# EAGLE design mainBoard (EAGLE 9.6.2)
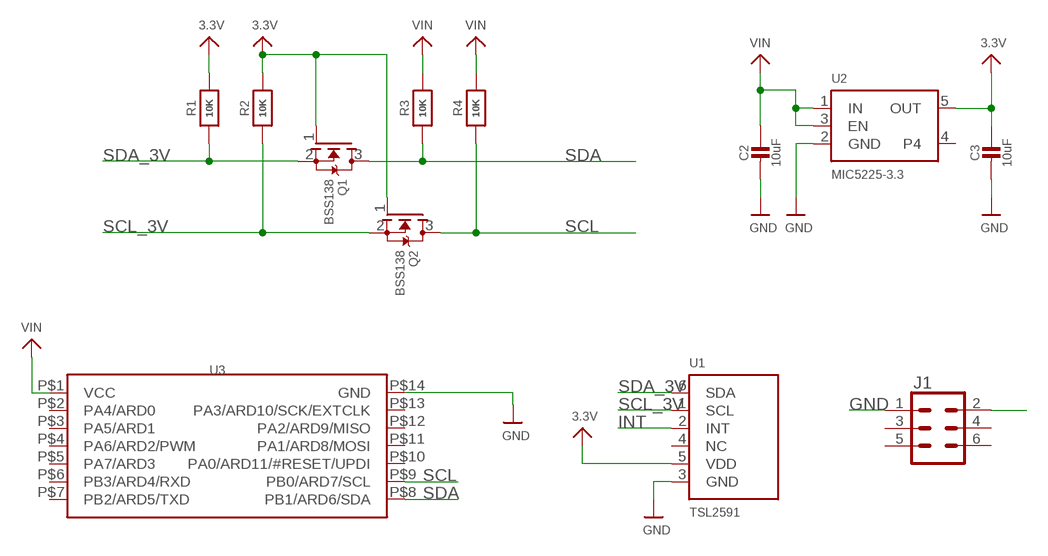
[diagram p0: schematic, sheet 1]

## Parts
C2  10uF  CAP_CERAMIC0805-NOOUTLINE  [0805-NO]
C3  10uF  CAP_CERAMIC0805-NOOUTLINE  [0805-NO]
J1  CONN_03X22X3_SILK_MALE_PTH  [2X3]
Q1  BSS138  MOSFET-NWIDE  [SOT23-WIDE]
Q2  BSS138  MOSFET-NWIDE  [SOT23-WIDE]
R1  10K  RESISTOR0805_NOOUTLINE  [0805-NO]
R2  10K  RESISTOR0805_NOOUTLINE  [0805-NO]
R3  10K  RESISTOR0805_NOOUTLINE  [0805-NO]
R4  10K  RESISTOR0805_NOOUTLINE  [0805-NO]
U1  TSL2591  LIGHT_TSL2591  [DFN6_TAOS]
U2  MIC5225-3.3  VREG_SOT23-5  [SOT23-5]
U3  ATTINY1604  [SOIC150]

## Nets
3.3V: C3.1 Q1.1(G) Q2.1(G) R1.2 R2.2 U1.5(VDD) U2.5(OUT)
GND: C2.2 C3.2 J1.1 U1.3(GND) U2.2(GND) U3.P$14(GND)
INT: U1.2(INT)
SCL: Q2.3(D) R4.1 U3.P$9(PB0/ARD7/SCL)
SCL_3V: Q2.2(S) R2.1 U1.1(SCL)
SDA: Q1.3(D) R3.1 U3.P$8(PB1/ARD6/SDA)
SDA_3V: Q1.2(S) R1.1 U1.6(SDA)
VIN: C2.1 J1.2 R3.2 R4.2 U2.1(IN) U2.3(EN) U3.P$1(VCC)
Unconnected: J1.3 J1.4 J1.5 J1.6 U1.4(NC) U2.4 U3.P$2(PA4/ARD0) U3.P$3(PA5/ARD1) U3.P$4(PA6/ARD2/PWM) U3.P$5(PA7/ARD3) U3.P$6(PB3/ARD4/RXD) U3.P$7(PB2/ARD5/TXD) U3.P$10(PA0/ARD11/#RESET/UPDI) U3.P$11(PA1/ARD8/MOSI) U3.P$12(PA2/ARD9/MISO) U3.P$13(PA3/ARD10/SCK/EXTCLK)

## Library data of the parts
C2 C3 = microbuilder:CAP_CERAMIC: Ceramic Capacitors For new designs, use the packages preceded by an '_' character since they are more reliable: The following footprints should be used on most boards: _0402 - Standard footprint for regular board layouts _0603 - Standard footprint for regular board layouts _0805 - Standard footprint for regular board layouts _1206 - Standard footprint for regular board layouts For extremely tight-pitch boards where space is at a premium, the following 'micro-pitch' footprints can be used (smaller pads, no silkscreen outline, etc.): _0402MP - Micro-pitch footprint for very dense/compact boards _0603MP - Micro-pitch footprint for very dense/compact boards _0805MP - Micro-pitch footprint for very dense/compact boards _1206MP - Micro-pitch footprint for very dense/compact boards
J1 = SparkFun-Connectors:CONN_03X2: Multi connection point. Often used as Generic Header-pin footprint for 0.1 inch spaced/style header connections You can populate with any combo of single row headers, but if you'd like an exact match, check these: Header - 2x3 (Male, 0.1") <https://www.sparkfun.com/products/12807> (PRT-12807) Header - 2x3 (Female, 0.1") <https://www.sparkfun.com/products/13010> (PRT-13010) 2x3 Pin Shrouded Header <https://www.sparkfun.com/products/10877> (PRT-10877) On any of the 0.1 inch spaced packages, you can populate with these: Break Away Headers - Straight <https://www.sparkfun.com/products/116> (PRT-00116) Break Away Male Headers - Right Angle <https://www.sparkfun.com/products/553> (PRT-00553) Female Headers <https://www.sparkfun.com/products/115> (PRT-00115) Break Away Headers - Machine Pin <https://www.sparkfun.com/products/117> (PRT-00117) Break Away Female Headers - Swiss Machine Pin <https://www.sparkfun.com/products/743> (PRT-00743) Special note: the shrouded connector mates well with our 3x2 ribbon cables: Ribbon Crimp Connector - 6-pin (2x3, Female) <https://www.sparkfun.com/products/10651> (PRT-10651) Ribbon Cable - 6 wire (15ft) <https://www.sparkfun.com/products/10646> (PRT-10646); PROD_ID: CONN-09701
Q1 Q2 = microbuilder:MOSFET-N: N-Channel Mosfet LEGEND VDS: Voltage Drain-Source ID: Drain Current RDS(ON): Drain-Source On-State Resistance VGS(TH): Gate-Source Threshold Voltage CISS: Drain-Source Input Capacitance SOT-23 Name VDS ID RDS(ON) VGS(TH) CISS Order Number 2N7002E 60V 260mA 2.5 Ohm 2.5V @ 250uA 26.7pF @ 25V 2N7002ET1GOSTR-ND BSH103 30V 850mA 400 mOhm 400mV @ 1mA 83pF @ 24V BSH103,235-ND BSS138 60V 320mA 1.6 Ohm 1.5V @ 250uA 50pF @ 10V Mouser: 771-BSS138PW115 DMN2075U-7 20V 4.2A 38 mOhm 1V @ 250 uA 594.3pF @ 10V DMN2075U-7DICT-ND * BSS138 good choice for I2C level-shifting POWERPAK 1212-8 Name VDS ID RDS(ON) VGS(TH) CISS Order Number Si7308DN 60V 6A 58 mOhm 3V @ 250uA 665pF @ 15V SI7308DN-T1-E3CT-ND
R1-R4 = microbuilder:RESISTOR: Resistors For new designs, use the packages preceded by an '_' character since they are more reliable: The following footprints should be used on most boards: _0402 - Standard footprint for regular board layouts _0603 - Standard footprint for regular board layouts _0805 - Standard footprint for regular board layouts _1206 - Standard footprint for regular board layouts For extremely tight-pitch boards where space is at a premium, the following 'micro-pitch' footprints can be used (smaller pads, no silkscreen outline, etc.): _0402MP - Micro-pitch footprint for very dense/compact boards _0603MP - Micro-pitch footprint for very dense/compact boards _0805MP - Micro-pitch footprint for very dense/compact boards _1206MP - Micro-pitch footprint for very dense/compact boards
U1 = microbuilder:LIGHT_TSL2591: TSL2591 Light-To-Digital Sensor
U2 = microbuilder:VREG_SOT23-5: SOT23-5 Fixed Voltage Regulators Part Current Out V Out V In V Dropout θJA (°C/W) TJ (°C) Digikey Part No. ADP121 150mA 3.3V 3.4-5.5V 0.09V @ 150mA -- -- ADP121-AUJZ33R7CT-ND ADP121 150mA 3.0V 3.1-5.5V 0.09V @ 150mA -- -- ADP121-AUJZ30R7CT-ND ADP122 300mA 3.3V 3.4-5.5V 0.085V @ 300mA -- -- ADP122AUJZ-3.3-R7CT-ND ADP1712 300mA 3.3V 3.5-5.5V 0.17V @ 300mA -- -- ADP1712AUJZ-3.3-R7TR-ND AP7311 (Low Cost) 150mA 3.3V 3.5-6V 0.15V @ 150mA -- -- AP7311-33WG-7DICT-ND LD39015M18R 150mA 1.8V 1.9V-5.5V 0.08V @ 100mA -- -- 497-6977-1-ND LP2985A-33DBVR 150mA 3.3V 3.3-16V 0.28V @ 150mA 206 150 296-18479-1-ND MCP1824T-3302E/OT 300mA 3.3V 3.5V-6V 0.2V @ 300mA -- -- MCP1824T-3302E/OTCT-ND MIC5205-2.5YM5 TR 150mA 2.5V 2.7-16V 0.165V @ 150mA -- -- 576-1257-2-ND MIC5205-3.0YM5 TR 150mA 3.0V 3.2V-16V 0.165V @ 150mA -- -- 576-1258-2-ND MIC5205-3.3YM5 TR 150mA 3.3V 3.5V-16V 0.165V @ 150mA -- -- 576-1259-2-ND TPS780330220 150mA 3.3V+2.2V 3.6-5.5V 250mV Max -- -- 296-23332-1-ND TDA3663/N1,135 100mA 3.3V 3.5-45V 0.18V @ 50mA -- -- 568-5343-1-ND Max operating temp can be calculated using θJA, TJ (max junction temperature), and power in watts. Set the "Maximum Ambient Temperature" until it reaches TJ ("Max Junction Temperature"), which is the absolute limit for safe use of the regulator: Heat Sink Temperature Calculator <http://www.daycounter.com/Calculators/Heat-Sink-Temperature-Calculator.phtml> For example, With 12V source into a 3.3V LP2985 and a 30mA load, we are dissipating (12V-3.3V) * 0.03A = 0.261W. With a θJA of 206 °C/W, a TJ of 150°C, and 261mW we can safely use the chip without a heat sink up to 75°C (=147.1°C Junction Temperature).
U3 = attiny1604:ATTINY1604: The ATtiny804/1604 microcontrollers are using the high-performance, low-power AVR® RISC architecture,and are capable of running at up to 20 MHz, with up to 8/16 KB Flash, 512/1024 bytes of SRAM, and128/256 bytes of EEPROM in a 14-pin package. The series uses the latest technologies with a flexibleand low-power architecture including Event System and SleepWalking, accurate analog features andadvanced peripherals.

## Board
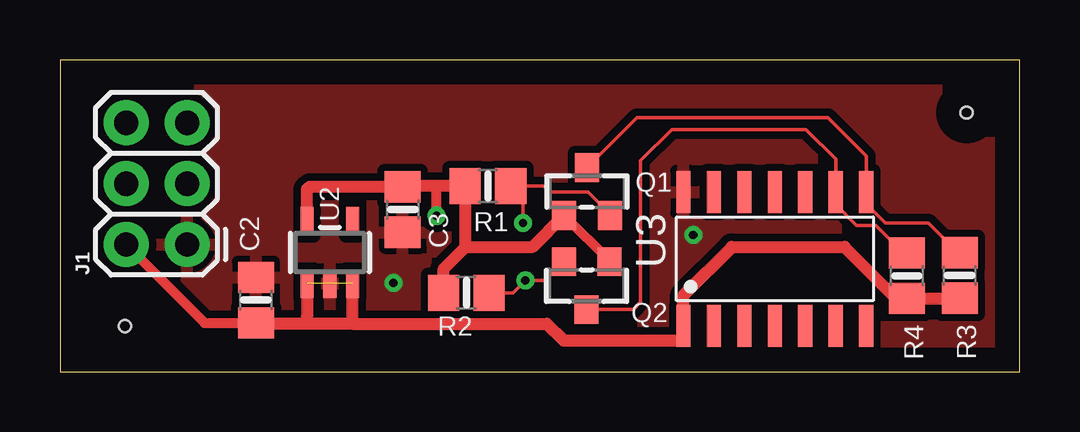
[diagram p1: board, top side]
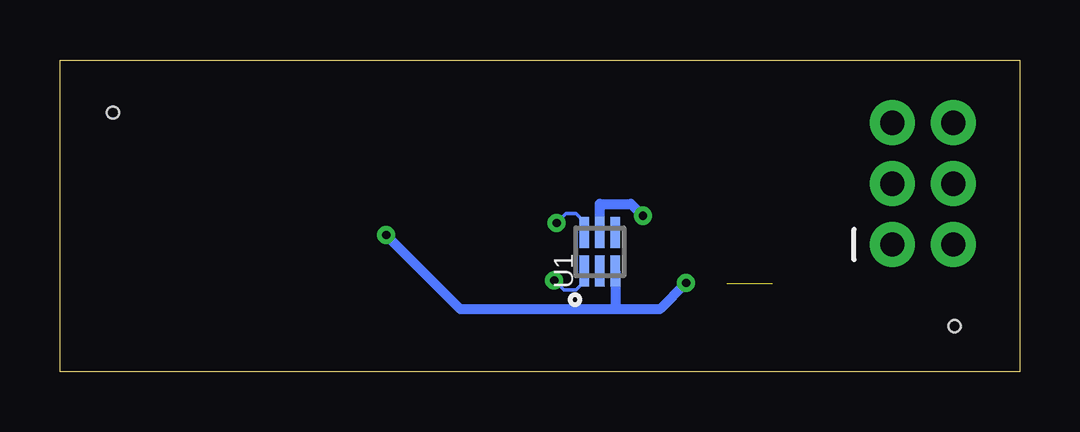
[diagram p2: board, bottom side, seen from below]

Size 40 x 13 mm. Coordinates in mm from the lower left corner, seen from the top.
Outline: 0,0 40,0 40,13 0,13 0,0
Copper layers (1*16): Top 0.035mm / dielectric 1.5mm / Bottom 0.035mm
Design rules "default": minimum track width 6mil, minimum drill 0.35mm, track to track 6mil, track to pad 6mil, pad to pad 6mil, via to via 6mil, smd to smd 6mil, copper to edge 40mil, drill to drill 6mil, minimum pad ring 10mil, minimum via ring 8mil, stop-mask expansion 4mil, vias tented up to drill 0mil, thermal gap 10mil
Holes 0.5 mm at 37.8,10.8 2.7,1.9

### Footprints (pad centres in the part's own frame; a part is rotated, then mirrored left to right if it is on the bottom)
0805-NO = smd 1.3 x 1.5: 1 -0.95,0; 2 0.95,0
2X3 = drill 1.016 pad 1.88: 1 0,0; 2 0,2.54; 3 2.54,0; 4 2.54,2.54; 5 5.08,0; 6 5.08,2.54
SOT23-WIDE = smd 1 x 1.2: 1 -0.95,-1; 2 0.95,-1; 3 0,1
DFN6_TAOS = smd 1.3 x 0.4: 1 -0.8,0.65; 2 -0.8,0; 3 -0.8,-0.65; 4 0.8,-0.65; 5 0.8,0; 6 0.8,0.65
SOT23-5 = smd 0.55 x 1.2: 1 -0.95,-1.3; 2 0,-1.3; 3 0.95,-1.3; 4 0.95,1.3; 5 -0.95,1.3
SOIC150 = smd 0.6 x 1.75: P$1 -3.81,-2.8; P$2 -2.54,-2.8; P$3 -1.27,-2.8; P$4 0,-2.8; P$5 1.27,-2.8; P$6 2.54,-2.8; P$7 3.81,-2.8; P$8 3.81,2.8; P$9 2.54,2.8; P$10 1.27,2.8; P$11 0,2.8; P$12 -1.27,2.8; P$13 -2.54,2.8; P$14 -3.81,2.8

### Placement (x,y rotation side)
C2  8.17,2.98 90 top
C3  14.29,6.76 270 top
J1  5.3,5.3 90 top
Q1  21.97,7.51 0 top
Q2  21.95,3.58 180 top
R1  17.84,7.74 180 top
R2  16.94,3.29 180 top
R3  37.5,4.01 270 top
R4  35.3,4 270 top
U1  17.5,5 90 bottom
U2  11.25,4.97 0 top
U3  29.8,4.7 0 top

### Tracks (layer width: path | path; a pad name or v marks a point on that pad's centre or on a via)
3.3V  (via drill 0.35)
  Top 0.152: 10.24,6.21 U2.5 | R2.2 | R1.2 17,7.63 | 14.3,7.74 C3.1
  Top 0.406: Q1.1 22.9,4.63 Q2.1 | v15.7,6.5 15.7,7.64 15.6,7.74
  Top 0.508: U2.5 10.3,7.6 10.41,7.71 C3.1 14.32,7.74 15.6,7.74 R1.2 16.89,5.21 16.9,5.2 | R2.2 15.99,4.29 16.9,5.2 | Q1.1 19.71,5.2 16.9,5.2
  Bottom 0.406: U1.5 17.5,7 16.2,7 v15.7,6.5
GND  (via drill 0.35)
  Top 0.152: 11.3,3.72 U2.2
  Bottom 0.406: v13.9,3.7 15,2.6 16.8,2.6 | 16.8,2.6 23.3,2.6 v26.4,5.7 | U1.3 16.85,2.65 16.8,2.6
  pour Top (isolate 0.305): -0.4,13.4 -0.4,13.7 40.7,13.7 40.7,-0.7 -0.7,-0.7 -0.7,13.4
SCL
  Top 0.152: U3.P$9 32.34,6.96 33.2,6.1 34,6.1 35.15,4.95 R4.1 | U3.P$9 32.3,7.54 | Q2.3 21.97,2.6 23.9,2.6 24.2,2.9 24.2,8.8 25.5,10.1 31.1,10.1 32.34,8.86 U3.P$9
SCL_3V  (via drill 0.35)
  Top 0.152: 20.98,4.6 Q2.2 20.22,3.8 v19.4,3.8 18.89,3.29 R2.1
  Bottom 0.152: U1.1 18.15,3.75 18.5,3.4 19,3.4 v19.4,3.8
SDA
  Top 0.152: R3.1 37.44,4.96 36.2,6.2 34.4,6.2 33.61,6.99 U3.P$8 33.61,8.99 32,10.6 24.06,10.6 Q1.3
SDA_3V  (via drill 0.35)
  Top 0.152: R1.1 19.3,7.74 | 19.3,7.74 20.16,7.74 20.4,7.5 22,7.5 22.92,6.58 Q1.2 | v19.3,6.2 19.3,7.74
  Bottom 0.152: U1.6 18.15,6.25 18.5,6.6 18.9,6.6 v19.3,6.2
VIN  (1 unrouted)
  Top 0.152: U2.1 10.28,3.69 | 35.25,3.05 R4.2 | R3.2
  Top 0.406: J1.2 6.03,2.03 C2.1
  Top 0.508: U2.1 10.3,2.3 | 12.2,2 U2.3 | 12.2,2 20.3,2 21,1.3 25.9,1.3 25.99,1.39 U3.P$1 25.99,3.19 28,5.2 32.7,5.2 34.85,3.05 R4.2 R3.2 | C2.1 8.17,2 12.2,2